# Altium schematic sheet MP1477H_DCDC_5V.SchDoc: TPS62133 DCDC 5V@3A
size A4; Author: Andrés Gullón; DocumentNumber: 6; Revision: 1.G.3; SheetNumber: 6; SheetTotal: 6
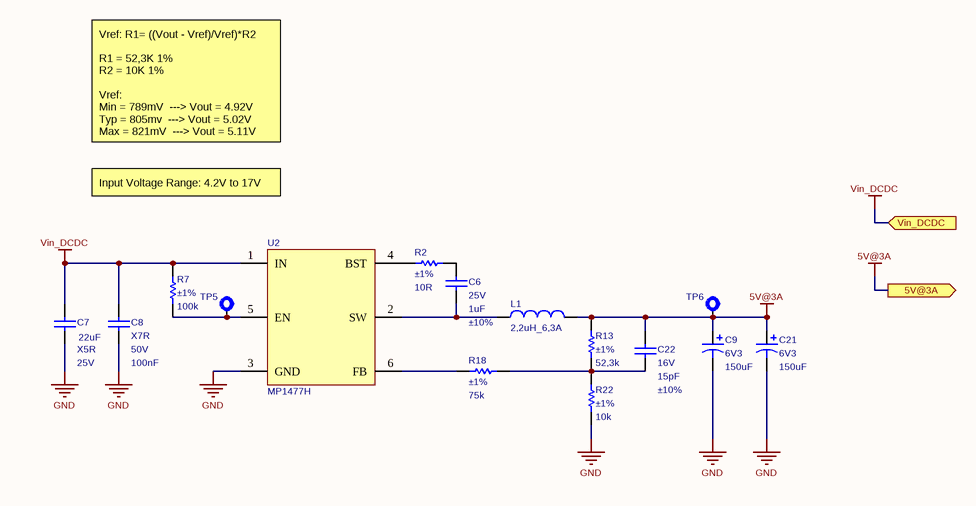
[diagram p0: MP1477H_DCDC_5V.SchDoc]

## Parts
C6  Voltage: 25V  Capacitance: 1uF  Tolerance: ±10%  [C0603]  (hidden comment: C0603_1uF_25V_±10%)
C7  Dielectric: X5R  Voltage: 25V  Capacitance: 22uF  [C1206]  (hidden comment: C1206_22uF_25V_±10%)
C8  Dielectric: X7R  Voltage: 50V  Capacitance: 100nF  [C0603]  (hidden comment: C0603_100nF_50V_±10%_X7R)
C9  Voltage: 6V3  Capacitance: 150uF  [CASE_B_3528-1411]  (hidden comment: 150uF_6V3_±20%)
C21  Voltage: 6V3  Capacitance: 150uF  [CASE_B_3528-1411]  (hidden comment: 150uF_6V3_±20%)
C22  Voltage: 16V  Capacitance: 15pF  Tolerance: ±10%  [C0402]  (hidden comment: C0402_15pF_16V_±10%_C0G)
L1  2,2uH_6,3A  [SRN8040]
R2  Tolerance: ±1%  Resistance: 10R  [R0402]  (hidden comment: R0402_10R_0.063W_±1%)
R7  Tolerance: ±1%  Resistance: 100k  [R0402]  (hidden comment: R0402_100k_0.063W_±1%)
R13  Tolerance: ±1%  Resistance: 52,3k  [R0402]  (hidden comment: R0402_52,3k_0.063W_±1%)
R18  Tolerance: ±1%  Resistance: 75k  [R0402]  (hidden comment: R0402_75k_0.063W_±1%)
R22  Tolerance: ±1%  Resistance: 10k  [R0402]  (hidden comment: R0402_10k_0.063W_±1%)
TP5  TP  [TP_POWER]  (value not drawn)  (no BOM)
TP6  TP  [TP_POWER]  (value not drawn)  (no BOM)
U2  MP1477H  [SOT-563 - MP1477H]

## Ports
5V@3A (out), Vin_DCDC (in)

## Nets
5V@3A: C9.1 C21.1 C22.2 L1.2 R13.1 TP6.1 ; port 5V@3A
GND: C7.1 C8.1 C9.2 C21.2 R22.2 U2.3(GND)
Vin_DCDC: C7.2 C8.2 R7.2 U2.1(IN) ; port Vin_DCDC
NetC6_1: C6.1 L1.1 U2.2(SW)
NetC6_2: C6.2 R2.2
NetC22_1: C22.1 R13.2 R18.2 R22.1
NetR2_1: R2.1 U2.4(BST)
NetR7_1: R7.1 TP5.1 U2.5(EN)
NetR18_1: R18.1 U2.6(FB)

## Notes on the sheet
- Input Voltage Range: 4.2V to 17V
- Vref: R1= ((Vout - Vref)/Vref)*R2
  R1 = 52,3K 1%
  R2 = 10K 1%
  Vref:
  Min = 789mV  ---> Vout = 4.92V
  Typ = 805mv  ---> Vout = 5.02V
  Max = 821mV  ---> Vout = 5.11V
- Title
- Project
- Size:
- Author
- A4
- Number:
- Revision:
- Mundo Reader, S.L. This project and all the sheets and layouts enclosed are licensed under Creative Commons by Attribution and Share Alike [CC BY-SA] (www.creativecommons.com)
- Date:
- Time:
- Sheet
- of

## Library data of the parts
C6 = CMP-A0371-1: Manufacturer: Kemet; Dielectric: X5R; Value: 1uF ±10% 25V; OrderingCode: C0603C105K3PAC; Temp_ Max: 125; Temp_ Min: -55; SchLibComponentName: Capacitor; Part Number: C0603_1uF_25V_±10%; Price units: EUR
C7 = CMP-A0110-1: Manufacturer: Murata; SchLibComponentName: Capacitor; Value: 22uF ±10% 25V; Tolerance: ±10%; OrderingCode: GRM31CR61E226KE15L; Temp_ Max: 85; Temp_ Min: -55; Part Number: C1206_22uF_25V_±10%; Price units: EUR
C8 = CMP-00257-1: Manufacturer: Kemet; Description ES: Condensador; OrderingCode: C0603C104K5RAC; OrderingCode 2: 06035C104KAT2A; SchLibComponentName: Capacitor; Temp_ Max: 125; Temp_ Min: -55; Tolerance: ±10%; Value: 100nF ±10% 50V; Manufacturer 2: AVX; Part Number: C0603_100nF_50V_±10%_X7R; Price units: EUR
C9 C21 = CMP-A2028-1: Manufacturer: Kemet; Value: 150uF ±20% 6V3; Tolerance: ±20%; ESR: 70m; OrderingCode: T520B157M006ATE070; Temp_ Max: 105; Temp_ Min: -55; SchLibComponentName: Tantalum; Part Number: 150uF_6V3_±20%; Price units: EUR
C22 = CMP-A0543-2: Manufacturer: Kemet; Dielectric: C0G; Value: 15pF ±10% 16V; OrderingCode: C0402C150K4GAC; Temp_ Max: 125; Temp_ Min: -55; Description ES: Condensador; SchLibComponentName: Capacitor; Part Number: C0402_15pF_16V_±10%; Price units: EUR
L1 = CMP-A0670-2: Semi-shielded power inductor; Manufacturer: Bourns; L: 2,2µH; Rdc: 0,013R; Current: 6,3A; Current Sat#: 7,3A; OrderingCode: SRN8040-2R2Y; Temp_ Max: 105; Temp_ Min: -40; Value: 2,2µH 6,3A; AccessRights: 2147483647; ContentType: Component; Current Sat.: 7,4A; Description ES: Bobina; Folder: Components Library\Pasives\Inductor_SMD\Power Inductor$\; RevisionId: 1; SchLibComponentName: Inductor; Part Number: 2,2uH_6,3A; Price units: EUR; ContentTypeGUID: CB3C11C4-E317-11DF-B822-12313F0024A2; FolderGUID: 60894C29-593F-4616-8F9E-CDB5863F0F96; ItemGUID: EAB2D04B-E49E-443A-801C-32E206E8EAE6; ItemHRID: CMP-A0670; LifeCycle: New From Design; LifeCycleStateGUID: 706004B5-C76E-482E-903B-BA0E4FAE086A; ReleaseDate: 19/02/2016 11:18:53 AM
R2 = CMP-A1838-2: Manufacturer: Vishay; Value: '=Resistance+' '+Tolerance+' '+Power; OrderingCode: CRCW040210R0FK; Power: 0.063W; Temp_ Max: 155; Temp_ Min: -55; Description ES: Resistencia; OrderingCode 2: RC0402FR-0710RL; Temp_Max: 155°C; Temp_Min: -55°C; SchLibComponentName: Resistor; PackageDescription: SMD; Part Number: R0402_10R_0.063W_±1%; Price units: EUR; Manufacturer 2: Yageo
R7 = CMP-A1835-2: Manufacturer: Vishay; Value: 100k ±1% 0.063W; OrderingCode: CRCW0402100KFK; Power: 0.063W; Description ES: Resistencia; Temp_ Max: 155; Temp_ Min: -55; SchLibComponentName: Resistor; PackageDescription: SMD; Part Number: R0402_100k_0.063W_±1%; Price units: EUR
R13 = CMP-A1961-1: Manufacturer: Vishay; Value: 52,3k ±1% 0.063W; OrderingCode: CRCW040252K3FK; Power: 0.063W; Temp_ Max: 155; Temp_ Min: -55; SchLibComponentName: Resistor; PackageDescription: SMD; Part Number: R0402_52,3k_0.063W_±1%; Price units: EUR
R18 = CMP-A1985-2: Manufacturer: Vishay; Value: 75k ±1% 0.063W; OrderingCode: CRCW040275K0FK; Power: 0.063W; Temp_ Max: 155; Temp_ Min: -55; Description ES: Resistencia; OrderingCode 2: RC0402FR-0775KL; Temp_Max: 155°C; Temp_Min: -55°C; SchLibComponentName: Resistor; PackageDescription: SMD; Part Number: R0402_75k_0.063W_±1%; Price units: EUR; Manufacturer 2: Yageo
R22 = CMP-A1837-1: Manufacturer: Vishay; Value: 10k ±1% 0.063W; OrderingCode: CRCW040210K0FK; Power: 0.063W; Temp_ Max: 155; Temp_ Min: -55; SchLibComponentName: Resistor; PackageDescription: SMD; Part Number: R0402_10k_0.063W_±1%; Price units: EUR
TP5 TP6 = CMP-A2499-3: Testpoint 0.3mm; Manufacturer: Oxley; OrderingCode: SMOX/060/B1; SAP: 303552; SchLibComponentName: Testpoint; Part Number: TP_POWER; Price units: EUR
U2 = CMP-00385-3: DCDC Step Down Vout= 1-5V; Vin= 12-17V; Manufacturer: MPS; Description ES: Regulador de voltaje; OrderingCode: MP1477GTF-Z; Temp_Max: 125; Temp_Min: -40; Part Number: MP1477GTF-Z; Price units: EUR